# Altium schematic sheet Power_Schematic.SchDoc
size A
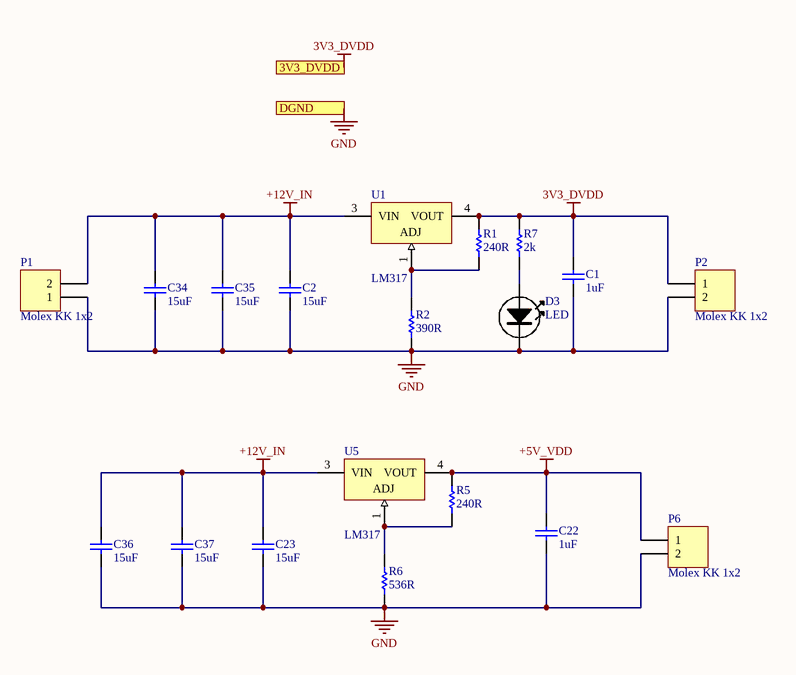
[diagram p0: Power_Schematic.SchDoc]

## Parts
C1  1uF  [C0805]
C2  15uF  [C0805]
C22  1uF  [C0805]
C23  15uF  [C0805]
C34  15uF  [C0805]
C35  15uF  [C0805]
C36  15uF  [C0805]
C37  15uF  [C0805]
D3  LED  [0805LED]
P1  Molex KK 1x2  [Molex KK 2x1]
P2  Molex KK 1x2  [Molex KK 2x1]
P6  Molex KK 1x2  [Molex KK 2x1]
R1  240R  [R0805]
R2  390R  [R0805]
R5  240R  [R0805]
R6  536R  [R0805]
R7  2k  [R0805]
U1  LM317  [D-PAK]
U5  LM317  [D-PAK]

## Ports
3V3_DVDD, DGND

## Nets
3V3_DVDD: C1.1 P2.1 R1.2 R7.2 U1.4(VOUT) ; port 3V3_DVDD
+5V_VDD: C22.1 P6.1 R5.2 U5.4(VOUT)
+12V_IN: C2.1 C23.1 C34.1 C35.1 C36.1 C37.1 P1.2 U1.3(VIN) U5.3(VIN)
GND: C1.2 C2.2 C22.2 C23.2 C34.2 C35.2 C36.2 C37.2 D3.K P1.1 P2.2 P6.2 R2.1 R6.1 ; port DGND
NetD3_A: D3.A R7.1
NetR1_1: R1.1 R2.2 U1.1(ADJ)
NetR5_1: R5.1 R6.2 U5.1(ADJ)

## Library data of the parts
C1 C2 C22 C23 C34-C37 = C0805: 0805 Capacitor
  C1 C22: Value: 1uF
  C2 C23 C34-C37: Value: 15uF
D3 = LED: Manufacturer: OSRAM Opto Semiconductors Inc; Manufacturer Part Number: LS T676-Q1R2-1-Z; Reel: D13
P1 P2 P6 = Molex KK 1x2: 1x2 Molex KK Connector
R1 R2 R5-R7 = R0805: RESISTOR 0805
  R1 R5: Value: 240R
  R2: Value: 390R
  R6: Value: 536R
  R7: Value: 2k
U1 U5 = LM317: Linear Voltage Regulator